# EAGLE design ez2013 (EAGLE 7.5.0)
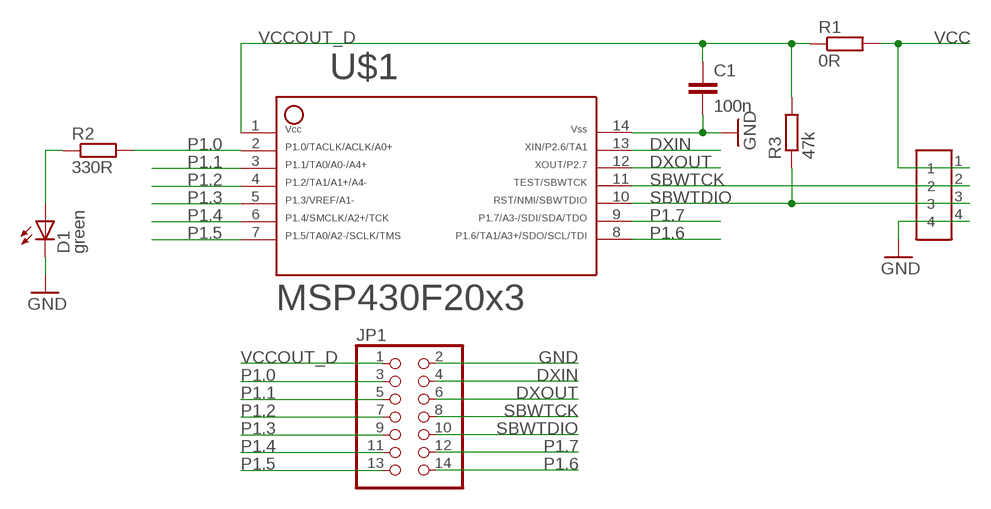
[diagram p0: schematic, sheet 1]

## Parts
C1  100n  C-EUC0805  [C0805]
D1  green  LEDCHIPLED_1206  [CHIPLED_1206]
JP1  PINHD-2X7  [2X07]
R1  0R  R-EU_R0805  [R0805]
R2  330R  R-EU_R0805  [R0805]
R3  47k  R-EU_R0805  [R0805]
U$1  F20X3---PW14  [PW14]
U$2  PINHD-1X4-1.27  [1X04-1.27]

## Nets
DXIN: JP1.4 U$1.13
DXOUT: JP1.6 U$1.12
GND: C1.2 D1.C JP1.2 U$1.14 U$2.4
N$8: D1.A R2.1
P1.0: JP1.3 R2.2 U$1.2
P1.1: JP1.5 U$1.3
P1.2: JP1.7 U$1.4
P1.3: JP1.9 U$1.5
P1.4: JP1.11 U$1.6
P1.5: JP1.13 U$1.7
P1.6: JP1.14 U$1.8
P1.7: JP1.12 U$1.9
SBWTCK: JP1.8 U$1.11 U$2.2
SBWTDIO: JP1.10 R3.1 U$1.10 U$2.3
VCC: R1.2 U$2.1
VCCOUT_D: C1.1 JP1.1 R1.1 R3.2 U$1.1

## Library data of the parts
C1 = resistor:C-EU: CAPACITOR, European symbol
D1 = led:LED: LED OSRAM: - CHIPLED LG R971, LG N971, LY N971, LG Q971, LY Q971, LO R971, LY R971 LH N974, LH R974 LS Q976, LO Q976, LY Q976 LO Q996 - Hyper CHIPLED LW Q18S LB Q993, LB Q99A, LB R99A - SideLED LS A670, LO A670, LY A670, LG A670, LP A670 LB A673, LV A673, LT A673, LW A673 LH A674 LY A675 LS A676, LA A676, LO A676, LY A676, LW A676 LS A679, LY A679, LG A679 - Hyper Micro SIDELED® LS Y876, LA Y876, LO Y876, LY Y876 LT Y87S - SmartLED LW L88C, LW L88S LB L89C, LB L89S, LG L890 LS L89K, LO L89K, LY L89K LS L896, LA L896, LO L896, LY L896 - TOPLED LS T670, LO T670, LY T670, LG T670, LP T670 LSG T670, LSP T670, LSY T670, LOP T670, LYG T670 LG T671, LOG T671, LSG T671 LB T673, LV T673, LT T673, LW T673 LH T674 LS T676, LA T676, LO T676, LY T676, LB T676, LH T676, LSB T676, LW T676 LB T67C, LV T67C, LT T67C, LS T67K, LO T67K, LY T67K, LW E67C LS E67B, LA E67B, LO E67B, LY E67B, LB E67C, LV E67C, LT E67C LW T67C LS T679, LY T679, LG T679 LS T770, LO T770, LY T770, LG T770, LP T770 LB T773, LV T773, LT T773, LW T773 LH T774 LS E675, LA E675, LY E675, LS T675 LS T776, LA T776, LO T776, LY T776, LB T776 LHGB T686 LT T68C, LB T68C - Hyper Mini TOPLED® LB M676 - Mini TOPLED Santana® LG M470 LS M47K, LO M47K, LY M47K Source: http://www.osram.convergy.de LUXEON: - LUMILED® LXK2-PW12-R00, LXK2-PW12-S00, LXK2-PW14-U00, LXK2-PW14-V00 LXK2-PM12-R00, LXK2-PM12-S00, LXK2-PM14-U00 LXK2-PE12-Q00, LXK2-PE12-R00, LXK2-PE12-S00, LXK2-PE14-T00, LXK2-PE14-U00 LXK2-PB12-K00, LXK2-PB12-L00, LXK2-PB12-M00, LXK2-PB14-N00, LXK2-PB14-P00, LXK2-PB14-Q00 LXK2-PR12-L00, LXK2-PR12-M00, LXK2-PR14-Q00, LXK2-PR14-R00 LXK2-PD12-Q00, LXK2-PD12-R00, LXK2-PD12-S00 LXK2-PH12-R00, LXK2-PH12-S00 LXK2-PL12-P00, LXK2-PL12-Q00, LXK2-PL12-R00 Source: www.luxeon.com KINGBRIGHT: KA-3528ASYC Source: www.kingbright.com
JP1 = 43oh-SugarAddict:PINHD-2X7: PIN HEADER
R1-R3 = resistor:R-EU_: RESISTOR, European symbol
U$1 = TI_MSP430_v16:F20X3---PW14: ***MSP430F20x3***PW14
U$2 = 43oh-SugarAddict:PINHD-1X4-1.27

## Board
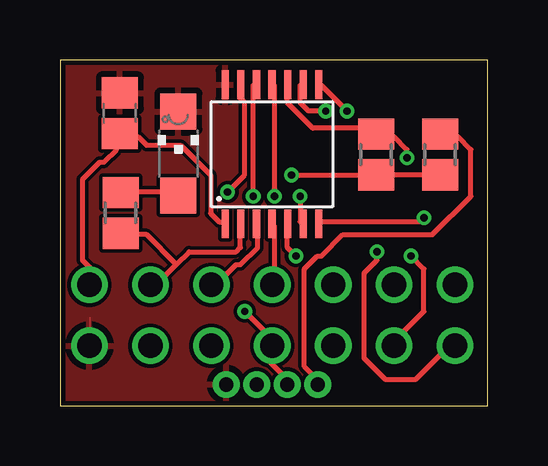
[diagram p1: board, top side]
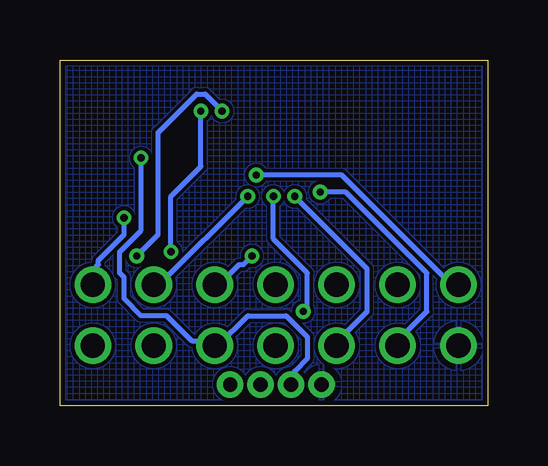
[diagram p2: board, bottom side, seen from below]

Size 17.83 x 14.43 mm. Coordinates in mm from the lower left corner, seen from the top.
Outline: 0,0 17.83,0 17.83,14.43 0,14.43 0,0
Copper layers (1*16): Top 0.035mm / dielectric 1.5mm / Bottom 0.035mm
Design rules "default *": minimum track width 8mil, minimum drill 12mil, track to track 6mil, track to pad 6mil, pad to pad 6mil, via to via 6mil, smd to smd 0mil, copper to edge 7mil, drill to drill 7mil, minimum pad ring 10mil, minimum via ring 6mil, stop-mask expansion 2mil, vias tented up to drill 100mil, thermal gap 10mil

### Footprints (pad centres in the part's own frame; a part is rotated, then mirrored left to right if it is on the bottom)
C0805 = smd 1.3 x 1.5: 1 -0.85,0; 2 0.85,0
CHIPLED_1206 = smd 1.5 x 1.5: A 0,-1.75; C 0,1.75
2X07 = drill 1.016 pad 1.422: 1 -7.62,-1.27; 2 -7.62,1.27; 3 -5.08,-1.27; 4 -5.08,1.27; 5 -2.54,-1.27; 6 -2.54,1.27; 7 0,-1.27; 8 0,1.27; 9 2.54,-1.27; 10 2.54,1.27; 11 5.08,-1.27; 12 5.08,1.27; 13 7.62,-1.27; 14 7.62,1.27
R0805 = smd 1.3 x 1.5: 1 -0.85,0; 2 0.85,0
PW14 = smd 0.3 x 1.2: 1 -1.95,-2.9; 2 -1.3,-2.9; 3 -0.65,-2.9; 4 0,-2.9; 5 0.65,-2.9; 6 1.3,-2.9; 7 1.95,-2.9; 8 1.95,2.9; 9 1.3,2.9; 10 0.65,2.9; 11 0,2.9; 12 -0.65,2.9; 13 -1.3,2.9; 14 -1.95,2.9
1X04-1.27 = drill 0.6 pad 1.016: 1 -1.905,0; 2 -0.635,0; 3 0.635,0; 4 1.905,0

### Placement (x,y rotation side)
C1  2.49,12.2 90 top
D1  4.93,10.52 0 top
JP1  8.84,3.78 180 bottom
R1  15.83,10.48 90 top
R2  2.52,8.05 270 top
R3  13.17,10.48 270 top
U$1  8.83,10.49 0 top
U$2  8.83,0.89 180 top

### Tracks (layer width: path | path; a pad name or v marks a point on that pad's centre or on a via)
DXIN  (via drill 0.3)
  Top 0.203: v6.98,8.91 7.7,9.63 7.7,12.65 7.52,12.83 7.52,13.36 U$1.13
  Bottom 0.203: v6.98,8.91 5.92,8.91 2.54,5.54 2.54,3.94 3.61,2.87 3.61,2.52 JP1.4
DXOUT  (via drill 0.3)
  Top 0.203: v8.05,8.74 8.05,13.36 U$1.12
  Bottom 0.203: v8.05,8.74 5.03,5.71 5.03,3.94 6.45,2.52 JP1.6
GND
  Top 0.051: JP1.2 1.27,2.51 1.27,3.68
  pour Top: 0,14.48 17.91,14.48 17.91,0 0,0
  pour Bottom (hatched): 0,14.35 17.91,14.35 17.91,0 0,0
N$8
  Top 0.203: R2.1 2.54,8.91 4.85,8.91 D1.A
P1.0
  Top 0.203: 4.85,5.89 4.14,5.18 3.79,5.18 JP1.3 | 4.85,5.89 5.38,6.43 7.34,6.43 7.52,6.6 7.52,7.49 U$1.2 | 4.85,5.89 3.61,7.14 2.54,7.14 R2.2
P1.1
  Top 0.203: U$1.3 8.23,7.49 8.23,6.6 7.52,5.89 7.34,5.89 6.45,5 JP1.5
P1.2
  Top 0.203: U$1.4 8.94,7.49 8.94,5.18 JP1.7
P1.3  (via drill 0.3)
  Top 0.203: v9.83,6.25 9.47,6.6 9.47,7.49 U$1.5
  Bottom 0.203: v9.83,6.25 10.19,5.89 10.36,5.89 11.25,5 JP1.9
P1.4  (via drill 0.3)
  Top 0.203: v10.01,8.74 10.01,7.67 U$1.6
  Bottom 0.203: v10.01,8.74 13.56,5.18 13.92,5.18 JP1.11
P1.5  (via drill 0.3)
  Top 0.203: v15.16,7.85 14.99,7.67 10.9,7.67 U$1.7
  Bottom 0.203: v15.16,7.85 15.16,7.14 16.23,6.07 16.23,5.89 16.41,5.71 16.41,5.18 JP1.13
P1.6  (via drill 0.3)
  Top 0.203: v11.96,12.29 10.9,13.36 U$1.8 | v13.21,6.43 13.21,6.07 12.68,5.54 12.68,1.98 13.56,1.09 14.81,1.09 16.05,2.34 16.41,2.34 JP1.14
  Bottom 0.203: v11.96,12.29 11.96,9.98 13.21,8.74 v13.21,6.43
P1.7  (via drill 0.3)
  Top 0.203: v11.07,12.29 10.36,12.29 10.01,12.65 10.01,13.36 U$1.9 | v14.63,6.25 15.16,5.71 15.16,3.94 14.1,2.87 14.1,2.52 JP1.12
  Bottom 0.203: v11.07,12.29 11.79,13 12.14,13 13.74,11.41 13.74,7.14 v14.63,6.25
SBWTCK  (via drill 0.3)
  Top 0.203: v8.94,8.74 8.94,13.36 U$1.11 | v7.7,3.94 8.76,2.87 8.76,2.52 JP1.8 8.76,2.34 8.76,1.8 9.3,1.27 9.3,0.91 U$2.2
  Bottom 0.203: v8.94,8.74 8.94,6.96 7.52,5.54 7.52,4.12 v7.7,3.94
SBWTDIO  (via drill 0.3)
  Top 0.203: U$1.10 9.47,13.36 9.47,12.65 10.54,11.58 12.85,11.58 13.03,11.41 R3.1 13.21,11.23 13.92,11.23 14.45,10.69 v14.45,10.34
  Bottom 0.203: U$2.3 8.05,0.91 8.05,1.45 7.52,1.98 7.52,2.87 8.41,3.76 10.01,3.76 11.25,2.52 JP1.10 11.43,2.52 11.61,2.69 12.32,2.69 13.39,3.76 14.45,3.76 15.16,4.47 15.16,5.36 15.34,5.54 15.34,6.43 14.45,7.32 v14.45,10.34
VCC
  Top 0.203: R1.2 15.87,11.23 16.59,11.23 17.12,10.69 17.12,8.74 15.52,7.14 11.79,7.14 10.9,6.25 10.72,6.25 10.19,5.71 10.19,1.63 10.9,0.91 U$2.1
VCCOUT_D  (via drill 0.3)
  Top 0.203: U$1.1 6.81,7.67 6.63,7.67 6.27,8.03 6.27,9.63 5.03,10.87 3.61,10.87 3.25,11.23 2.54,11.23 C1.1 2.36,11.23 2.36,10.69 1.83,10.16 1.65,10.16 0.94,9.45 0.94,6.07 1.29,5.71 1.29,5.18 JP1.1 | R1.1 15.7,9.63 13.21,9.63 R3.2 13.03,9.63 v9.65,9.63
  Bottom 0.203: v9.65,9.63 6.1,9.63 1.65,5.18 1.29,5.18 JP1.1